# Altium schematic sheet Sheet6.SchDoc
size A4; SheetNumber: 1; SheetTotal: 2
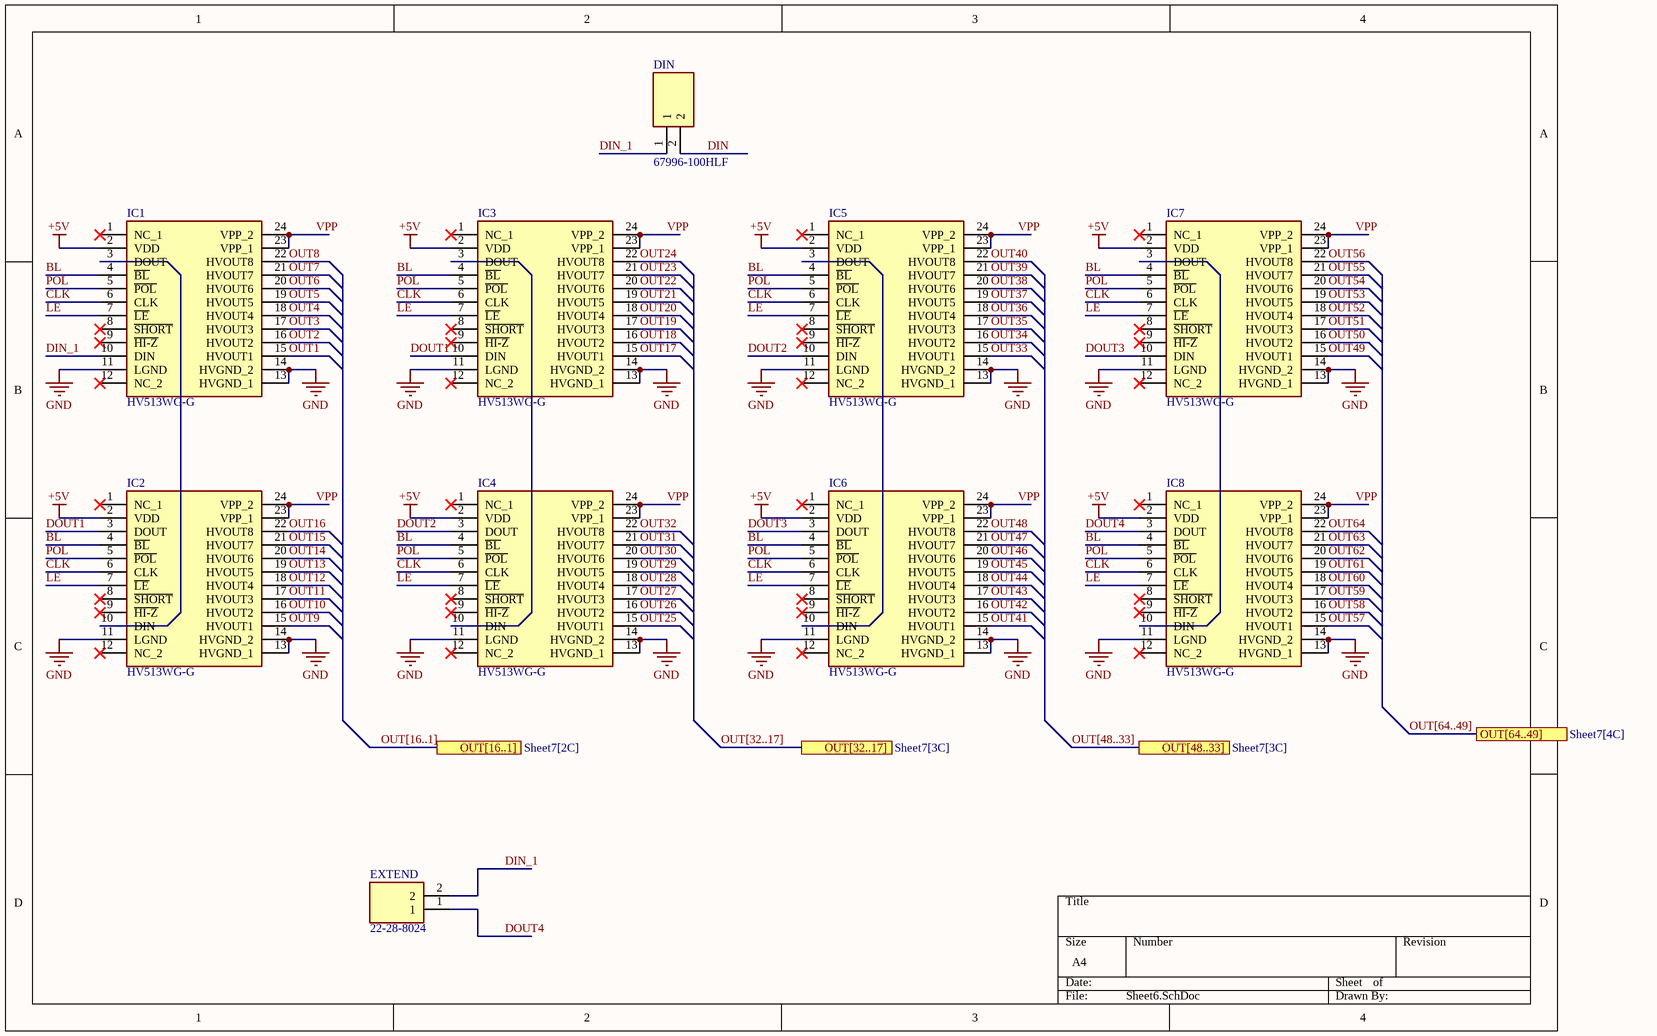
[diagram p0: Sheet6.SchDoc]

## Parts
DIN  67996-100HLF  [HDRV2W67P254_2X1_254X483X858P]
EXTEND  22-28-8024  [HDRRA2W66P0X254_1X2_508X229X274P]
IC1  HV513WG-G  [SOIC127P1030X265-24N]
IC2  HV513WG-G  [SOIC127P1030X265-24N]
IC3  HV513WG-G  [SOIC127P1030X265-24N]
IC4  HV513WG-G  [SOIC127P1030X265-24N]
IC5  HV513WG-G  [SOIC127P1030X265-24N]
IC6  HV513WG-G  [SOIC127P1030X265-24N]
IC7  HV513WG-G  [SOIC127P1030X265-24N]
IC8  HV513WG-G  [SOIC127P1030X265-24N]

## Ports
OUT[16..1] (see Sheet7[2C]), OUT[32..17] (see Sheet7[3C]), OUT[48..33] (see Sheet7[3C]), OUT[64..49] (see Sheet7[4C])

## Nets
+5V: IC1.2(VDD) IC2.2(VDD) IC3.2(VDD) IC4.2(VDD) IC5.2(VDD) IC6.2(VDD) IC7.2(VDD) IC8.2(VDD)
GND: IC1.11(LGND) IC1.13(HVGND_1) IC1.14(HVGND_2) IC2.11(LGND) IC2.13(HVGND_1) IC2.14(HVGND_2) IC3.11(LGND) IC3.13(HVGND_1) IC3.14(HVGND_2) IC4.11(LGND) IC4.13(HVGND_1) IC4.14(HVGND_2) IC5.11(LGND) IC5.13(HVGND_1) IC5.14(HVGND_2) IC6.11(LGND) IC6.13(HVGND_1) IC6.14(HVGND_2) IC7.11(LGND) IC7.13(HVGND_1) IC7.14(HVGND_2) IC8.11(LGND) IC8.13(HVGND_1) IC8.14(HVGND_2)
BL: IC1.4(~{BL}) IC2.4(~{BL}) IC3.4(~{BL}) IC4.4(~{BL}) IC5.4(~{BL}) IC6.4(~{BL}) IC7.4(~{BL}) IC8.4(~{BL})
CLK: IC1.6(CLK) IC2.6(CLK) IC3.6(CLK) IC4.6(CLK) IC5.6(CLK) IC6.6(CLK) IC7.6(CLK) IC8.6(CLK)
DIN: DIN.2
DIN_1: DIN.1 EXTEND.2 IC1.10(DIN)
DOUT1: IC2.3(DOUT) IC3.10(DIN)
DOUT2: IC4.3(DOUT) IC5.10(DIN)
DOUT3: IC6.3(DOUT) IC7.10(DIN)
DOUT4: EXTEND.1 IC8.3(DOUT)
LE: IC1.7(~{LE}) IC2.7(~{LE}) IC3.7(~{LE}) IC4.7(~{LE}) IC5.7(~{LE}) IC6.7(~{LE}) IC7.7(~{LE}) IC8.7(~{LE})
OUT1: IC1.15(HVOUT1)
OUT2: IC1.16(HVOUT2)
OUT3: IC1.17(HVOUT3)
OUT4: IC1.18(HVOUT4)
OUT5: IC1.19(HVOUT5)
OUT6: IC1.20(HVOUT6)
OUT7: IC1.21(HVOUT7)
OUT8: IC1.22(HVOUT8)
OUT9: IC2.15(HVOUT1)
OUT10: IC2.16(HVOUT2)
OUT11: IC2.17(HVOUT3)
OUT12: IC2.18(HVOUT4)
OUT13: IC2.19(HVOUT5)
OUT14: IC2.20(HVOUT6)
OUT15: IC2.21(HVOUT7)
OUT16: IC2.22(HVOUT8)
OUT17: IC3.15(HVOUT1)
OUT18: IC3.16(HVOUT2)
OUT19: IC3.17(HVOUT3)
OUT20: IC3.18(HVOUT4)
OUT21: IC3.19(HVOUT5)
OUT22: IC3.20(HVOUT6)
OUT23: IC3.21(HVOUT7)
OUT24: IC3.22(HVOUT8)
OUT25: IC4.15(HVOUT1)
OUT26: IC4.16(HVOUT2)
OUT27: IC4.17(HVOUT3)
OUT28: IC4.18(HVOUT4)
OUT29: IC4.19(HVOUT5)
OUT30: IC4.20(HVOUT6)
OUT31: IC4.21(HVOUT7)
OUT32: IC4.22(HVOUT8)
OUT33: IC5.15(HVOUT1)
OUT34: IC5.16(HVOUT2)
OUT35: IC5.17(HVOUT3)
OUT36: IC5.18(HVOUT4)
OUT37: IC5.19(HVOUT5)
OUT38: IC5.20(HVOUT6)
OUT39: IC5.21(HVOUT7)
OUT40: IC5.22(HVOUT8)
OUT41: IC6.15(HVOUT1)
OUT42: IC6.16(HVOUT2)
OUT43: IC6.17(HVOUT3)
OUT44: IC6.18(HVOUT4)
OUT45: IC6.19(HVOUT5)
OUT46: IC6.20(HVOUT6)
OUT47: IC6.21(HVOUT7)
OUT48: IC6.22(HVOUT8)
OUT49: IC7.15(HVOUT1)
OUT50: IC7.16(HVOUT2)
OUT51: IC7.17(HVOUT3)
OUT52: IC7.18(HVOUT4)
OUT53: IC7.19(HVOUT5)
OUT54: IC7.20(HVOUT6)
OUT55: IC7.21(HVOUT7)
OUT56: IC7.22(HVOUT8)
OUT57: IC8.15(HVOUT1)
OUT58: IC8.16(HVOUT2)
OUT59: IC8.17(HVOUT3)
OUT60: IC8.18(HVOUT4)
OUT61: IC8.19(HVOUT5)
OUT62: IC8.20(HVOUT6)
OUT63: IC8.21(HVOUT7)
OUT64: IC8.22(HVOUT8)
POL: IC1.5(~{POL}) IC2.5(~{POL}) IC3.5(~{POL}) IC4.5(~{POL}) IC5.5(~{POL}) IC6.5(~{POL}) IC7.5(~{POL}) IC8.5(~{POL})
VPP: IC1.23(VPP_1) IC1.24(VPP_2) IC2.23(VPP_1) IC2.24(VPP_2) IC3.23(VPP_1) IC3.24(VPP_2) IC4.23(VPP_1) IC4.24(VPP_2) IC5.23(VPP_1) IC5.24(VPP_2) IC6.23(VPP_1) IC6.24(VPP_2) IC7.23(VPP_1) IC7.24(VPP_2) IC8.23(VPP_1) IC8.24(VPP_2)
NetIC1_3: IC1.3(DOUT) IC2.10(DIN)
NetIC3_3: IC3.3(DOUT) IC4.10(DIN)
NetIC5_3: IC5.3(DOUT) IC6.10(DIN)
NetIC7_3: IC7.3(DOUT) IC8.10(DIN)

Not connected (* = marked no-connect by the designer): IC1 1(NC_1)* 8(~{SHORT})* 9(~{HI-Z})* 12(NC_2)*; IC2 1(NC_1)* 8(~{SHORT})* 9(~{HI-Z})* 12(NC_2)*; IC3 1(NC_1)* 8(~{SHORT})* 9(~{HI-Z})* 12(NC_2)*; IC4 1(NC_1)* 8(~{SHORT})* 9(~{HI-Z})* 12(NC_2)*; IC5 1(NC_1)* 8(~{SHORT})* 9(~{HI-Z})* 12(NC_2)*; IC6 1(NC_1)* 8(~{SHORT})* 9(~{HI-Z})* 12(NC_2)*; IC7 1(NC_1)* 8(~{SHORT})* 9(~{HI-Z})* 12(NC_2)*; IC8 1(NC_1)* 8(~{SHORT})* 9(~{HI-Z})* 12(NC_2)*

## Buses and harness runs
bus OUT[16..1] = port OUT[16..1]
bus OUT[32..17] = port OUT[32..17]
bus OUT[48..33] = port OUT[48..33]
bus OUT[64..49] = port OUT[64..49]

## Library data of the parts
DIN = 67996-100HLF: BergStik<sup>&reg;</sup>, Board to Board connector, Unshrouded vertical header, Through Hole, Double Row, 0 Positions, 2.54 mm (0.100in) Pitch; Manufacturer_Name: Amphenol Communications Solutions; Geometry.Height: 8.58mm; Mouser Part Number: *; Mouser Price/Stock: *; Manufacturer_Part_Number: 67996-100HLF; Datasheet Link: https://cdn.amphenol-cs.com/media/wysiwyg/files/drawing/67996.pdf
EXTEND = 22-28-8024: Connector; Manufacturer_Name: Molex; Datasheet Link: https://www.molex.com/pdm_docs/sd/022288024_sd.pdf; Height: 2.74mm; Manufacturer_Part_Number: 22-28-8024
IC1-IC8 = HV513WG-G: Integrated Circuit; Manufacturer_Name: Microchip; Datasheet Link: http://ww1.microchip.com/downloads/en/DeviceDoc/20005846A.pdf; Height: 2.65mm; Manufacturer_Part_Number: HV513WG-G; Mouser Part Number: 689-HV513WG-G; Mouser Price/Stock: https://www.mouser.co.uk/ProductDetail/Microchip-Technology/HV513WG-G?qs=wSTxOR59s%2FzutPVpK8md7g%3D%3D; Arrow Part Number: HV513WG-G; Arrow Price/Stock: https://www.arrow.com/en/products/hv513wg-g/microchip-technology?region=nac